# Altium project Control_Panel.PrjPCB
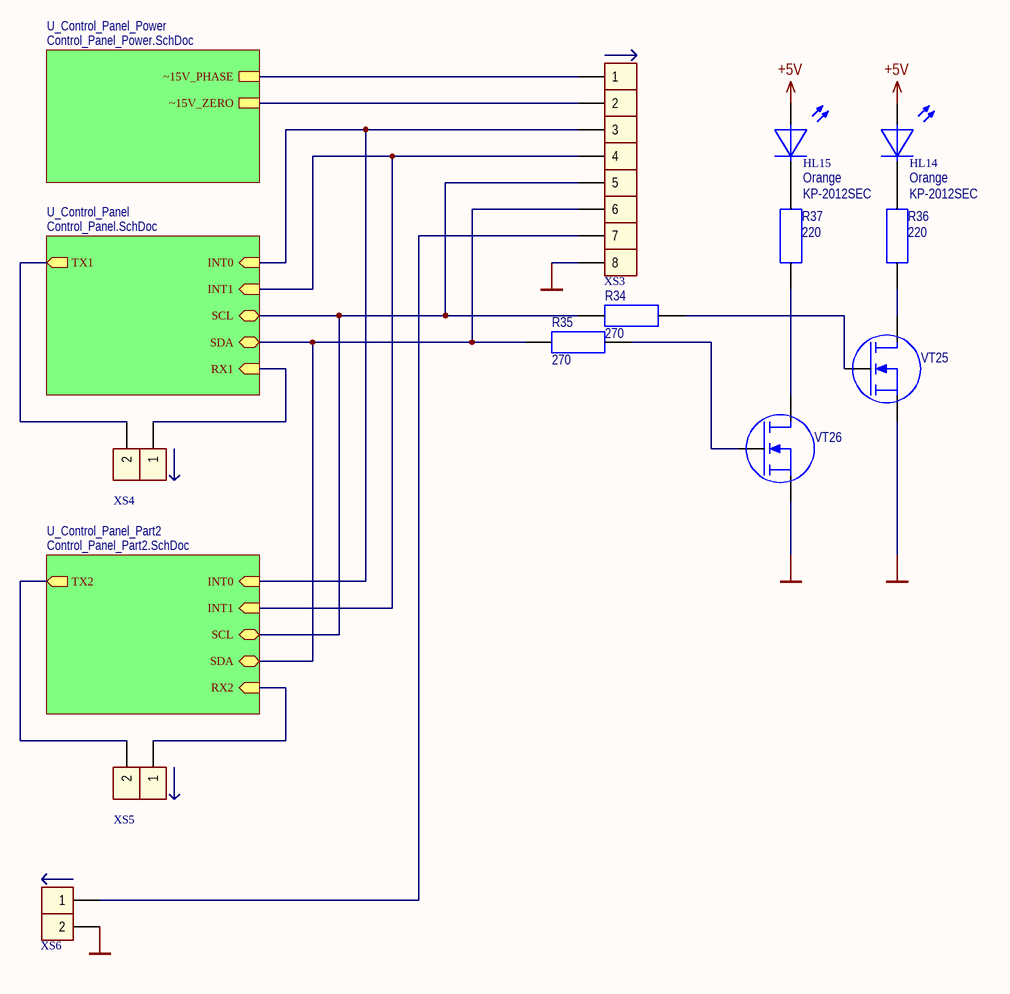
[diagram p0: TopShem.SchDoc]
5 sheets, 144 parts. Net scope: hierarchical (ports join the sheet entries above them; power ports are global).
Board file: Control_Panel.PcbDoc
Sheets:
  TopShem.SchDoc
    U_Control_Panel_Power = Control_Panel_Power.SchDoc
    U_Control_Panel = Control_Panel.SchDoc
    U_Control_Panel_Part2 = Control_Panel_Part2.SchDoc
      TransistorArray = TransistorArray.SchDoc

## Sheet TopShem.SchDoc: Наименование
size 420 x 297 mm; ApprovedBy: Сидоров; CheckedBy: Петров; Author: Иванов; CompanyName: РГППУ; Title2str: Изделия; DecimalNumber: АБВГ.123456.001 33

### Parts
HL14  Orange  ManufacturerPartNumber: KP-2012SEC  [DIOMELF2012M]
HL15  Orange  ManufacturerPartNumber: KP-2012SEC  [DIOMELF2012M]
R34  270  [SMDRC0805]
R35  270  [SMDRC0805]
R36  220  [SMDRC0805]
R37  220  [SMDRC0805]
VT25  2N7002  [SOT23 (TO-236AB)]  (value not drawn)
VT26  2N7002  [SOT23 (TO-236AB)]  (value not drawn)
XS3  PLS-08R  [PLS-08R2]  (value not drawn)
XS4  PLS-02  [PLS-02]  (value not drawn)
XS5  PLS-02  [PLS-02]  (value not drawn)
XS6  PLS-02R  [PLS-02R1]  (value not drawn)

### Sub-sheets
U_Control_Panel = Control_Panel.SchDoc: INT0 (in), INT1 (in), SCL (bidir), SDA (bidir), RX1 (in), TX1 (out)
U_Control_Panel_Part2 = Control_Panel_Part2.SchDoc: INT0 (in), INT1 (in), SCL (bidir), SDA (bidir), RX2 (in), TX2 (out)
U_Control_Panel_Power = Control_Panel_Power.SchDoc: ~15V_PHASE, ~15V_ZERO

### Nets
+5V: HL14.1 HL15.1
GND: VT25.2(S) VT26.2(S) XS3.8 XS6.2
INT0: XS3.3 ; sheet U_Control_Panel/INT0, sheet U_Control_Panel_Part2/INT0
INT1: XS3.4 ; sheet U_Control_Panel/INT1, sheet U_Control_Panel_Part2/INT1
RX1: XS4.1 ; sheet U_Control_Panel/RX1
RX2: XS5.1 ; sheet U_Control_Panel_Part2/RX2
SCL: R34.2 XS3.5 ; sheet U_Control_Panel/SCL, sheet U_Control_Panel_Part2/SCL
SDA: R35.2 XS3.6 ; sheet U_Control_Panel/SDA, sheet U_Control_Panel_Part2/SDA
TX1: XS4.2 ; sheet U_Control_Panel/TX1
TX2: XS5.2 ; sheet U_Control_Panel_Part2/TX2
~15V_PHASE: XS3.1 ; sheet U_Control_Panel_Power/~15V_PHASE
~15V_ZERO: XS3.2 ; sheet U_Control_Panel_Power/~15V_ZERO
NetHL14_2: HL14.2 R36.2
NetHL15_2: HL15.2 R37.2
NetR34_1: R34.1 VT25.1(G)
NetR35_1: R35.1 VT26.1(G)
NetR36_1: R36.1 VT25.3(D)
NetR37_1: R37.1 VT26.3(D)
NetXS3_7: XS3.7 XS6.1

### Notes on the sheet
- Изм.
- Лист
- N*докум.
- Подп.
- Дата
- Лит.
- Масса
- Масштаб
- Разраб.
- Пров.
- Т.контр.
- Лиcт
- Лиcтов
- Н.контр.
- Утв.

### Library data of the parts
HL14 HL15 = LED1_O: Diod LED SMD Orange; ComponentLink1Description: Datasheet; Cost: 4,91; ComponentLink2Description: Datasheet-local; ComponentLink2URL: *; Color: Orange
R34 R35 = Resistor 0805 270: Generic resistor; PartNumber: Resistor 0805 270; Value: 270; ComponentLink1URL: http://www.mouser.com/ds/2/447/PYu-RC0402_51_RoHS_L_6_r-8721.pdf; ComponentLink1Description: Datasheet; Package: 0805
R36 R37 = Resistor 0805 220: Generic resistor; PartNumber: Resistor 0805 220; Value: 220; ComponentLink1URL: http://www.mouser.com/ds/2/447/PYu-RC0402_51_RoHS_L_6_r-8721.pdf; ComponentLink1Description: Datasheet; Package: 0805
VT25 VT26 = 2N7002 n-MOSFET: 60V, 300mA N-channel Trench MOSFET; ManufacturerPartNumber: 2N7002
XS3 = Con8_M PLS-08MR: Male 8-pin connection; ManufacturerPartNumber: PLS-08R; ComponentLink1Description: Datasheet; ComponentLink1URL: http://www.promelec.ru/catalog/406/1218/1223/1/99528/; ComponentLink2Description: Datasheet-local; ComponentLink2URL: *
XS4 XS5 = Con2_M_PLS-02: Male 2-pin connection; ManufacturerPartNumber: PLS-02; ComponentLink1Description: Datasheet; ComponentLink1URL: http://www.promelec.ru/catalog/406/1218/1224/1/24233/; ComponentLink2Description: Datasheet-local; ComponentLink2URL: *
XS6 = Con2_M_PLS-02R: Male 2-pin connection; ManufacturerPartNumber: PLS-02R; ComponentLink1Description: Datasheet; ComponentLink1URL: http://www.promelec.ru/catalog/406/1218/1224/1/24233/; ComponentLink2Description: Datasheet-local; ComponentLink2URL: *

## Sheet Control_Panel_Power.SchDoc: Наименование
size 420 x 297 mm; ApprovedBy: Сидоров; CheckedBy: Петров; Author: Иванов; CompanyName: РГППУ; Title2str: Изделия; DecimalNumber: АБВГ.123456.001 33
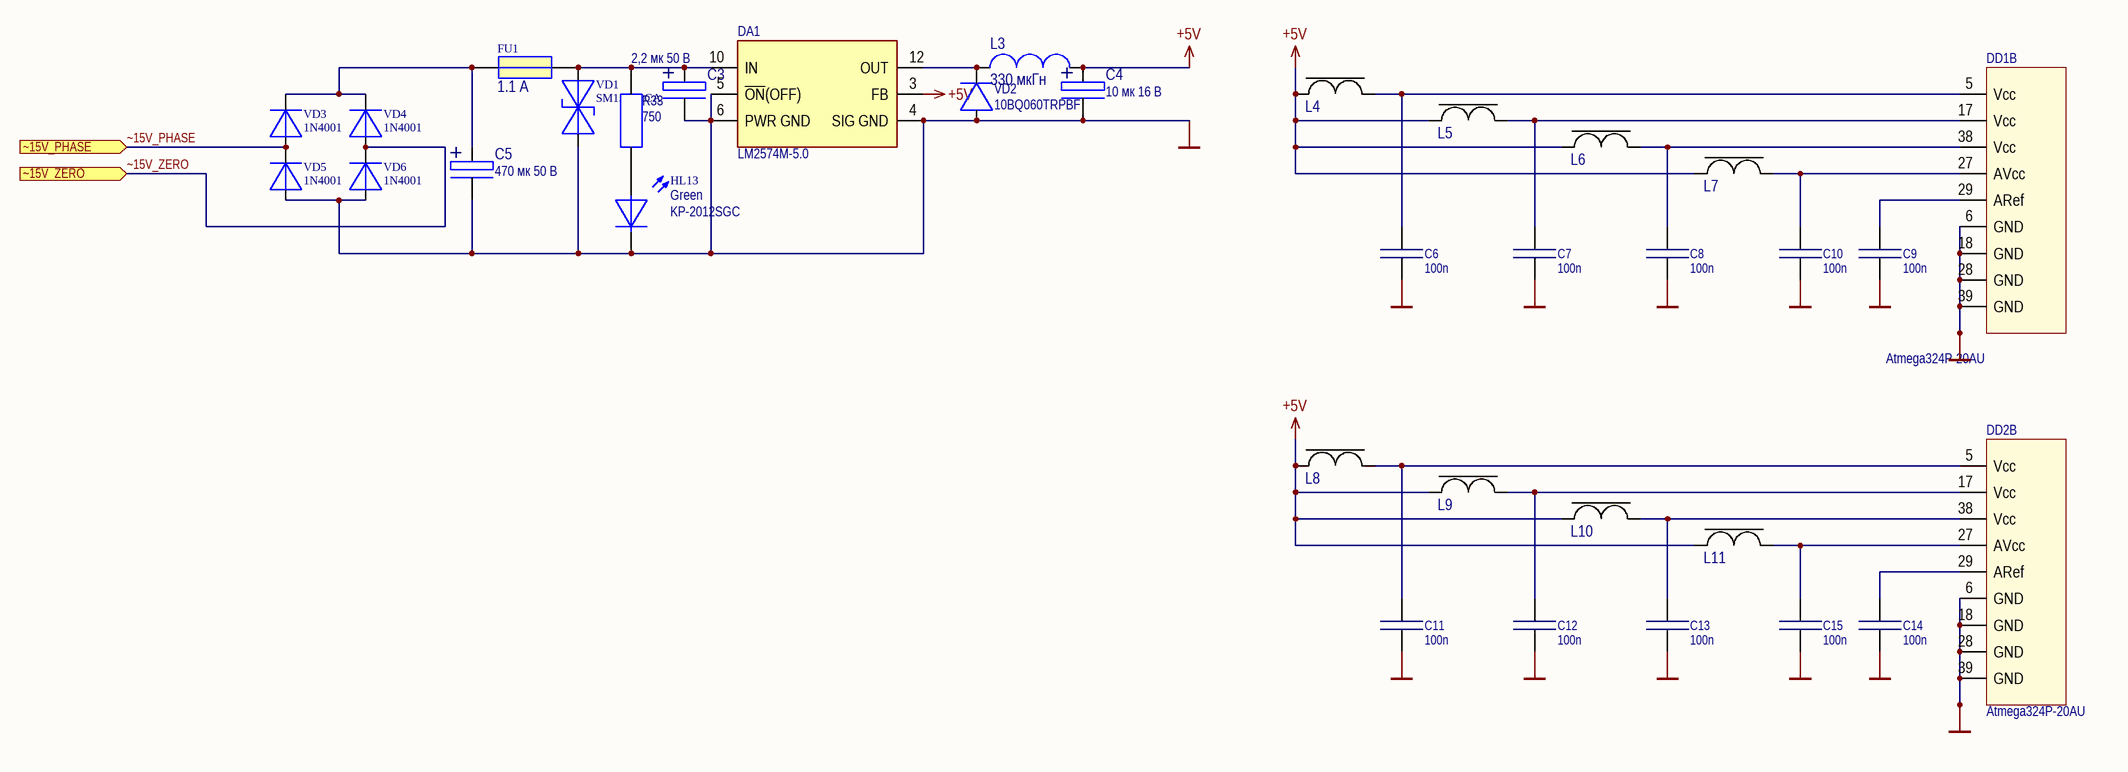
[diagram p1: Control_Panel_Power.SchDoc]

### Parts
C3  value 2,2 мк 50 В  [CAP_POLAR_ELLYTE_B]  (hidden comment: CA050M2R20REB-0405)
C4  value 10 мк 16 В  [CAP_POLAR_ELLYTE_B]  (hidden comment: CA016M0010REB-0405)
C5  value 470 мк 50 В  [CAP_POLAR_10mm]  (hidden comment: CA035M0220REG)
C6  100n  [SMDRC0805]
C7  100n  [SMDRC0805]
C8  100n  [SMDRC0805]
C9  100n  [SMDRC0805]
C10  100n  [SMDRC0805]
C11  100n  [SMDRC0805]
C12  100n  [SMDRC0805]
C13  100n  [SMDRC0805]
C14  100n  [SMDRC0805]
C15  100n  [SMDRC0805]
DA1  LM2574M-5.0  [SOIC127P1030X264-14M]
DD1  Atmega324P-20AU  [44ML_M]  (part B of 2)
DD2  Atmega324P-20AU  [44ML_M]  (part B of 2)
FU1  value 1.1 А  [EFuse 1.1A]  (hidden comment: EFuse LP60-110F)
HL13  Green  ManufacturerPartNumber: KP-2012SGC  [DIOMELF2012M]
L3  value 330 мкГн  [INDP7972X50M]  (hidden comment: SCD0705T-331K-N)
L4  MPZ1608S181A  [INDC0603X03M]  (value not drawn)
L5  MPZ1608S181A  [INDC0603X03M]  (value not drawn)
L6  MPZ1608S181A  [INDC0603X03M]  (value not drawn)
L7  MPZ1608S181A  [INDC0603X03M]  (value not drawn)
L8  MPZ1608S181A  [INDC0603X03M]  (value not drawn)
L9  MPZ1608S181A  [INDC0603X03M]  (value not drawn)
L10  MPZ1608S181A  [INDC0603X03M]  (value not drawn)
L11  MPZ1608S181A  [INDC0603X03M]  (value not drawn)
R33  750  [SMDRC0805]
VD1  SM15T12CA  [SUPRES3216X18N]
VD2  10BQ060TRPBF  [SHOTKY 4.1x3.3]
VD3  1N4001  [PinDiode]
VD4  1N4001  [PinDiode]
VD5  1N4001  [PinDiode]
VD6  1N4001  [PinDiode]

### Ports
~15V_PHASE, ~15V_ZERO

### Nets
+5V: C4.2(+) DA1.3(FB) L3.1 L4.1 L5.1 L6.1 L7.1 L8.1 L9.1 L10.1 L11.1
GND: C3.1(-) C4.1(-) C5.1(-) C6.2 C7.2 C8.2 C9.2 C10.1 C11.2 C12.2 C13.2 C14.2 C15.1 DA1.4(SIG_GND) DA1.5(~{ON}(OFF)) DA1.6(PWR_GND) DD1.6(GND) DD1.18(GND) DD1.28(GND) DD1.39(GND) DD2.6(GND) DD2.18(GND) DD2.28(GND) DD2.39(GND) HL13.2 VD1.1 VD2.A VD5.A VD6.A
~15V_PHASE: VD3.A VD5.K ; port ~15V_PHASE
~15V_ZERO: VD4.A VD6.K ; port ~15V_ZERO
NetC3_2: C3.2(+) DA1.10(IN) FU1.2 R33.2 VD1.2
NetC5_2: C5.2(+) FU1.1 VD3.K VD4.K
NetC6_1: C6.1 DD1.5(Vcc) L4.2
NetC7_1: C7.1 DD1.17(Vcc) L5.2
NetC8_1: C8.1 DD1.38(Vcc) L6.2
NetC9_1: C9.1 DD1.29(ARef)
NetC10_2: C10.2 DD1.27(AVcc) L7.2
NetC11_1: C11.1 DD2.5(Vcc) L8.2
NetC12_1: C12.1 DD2.17(Vcc) L9.2
NetC13_1: C13.1 DD2.38(Vcc) L10.2
NetC14_1: C14.1 DD2.29(ARef)
NetC15_2: C15.2 DD2.27(AVcc) L11.2
NetDA1_12: DA1.12(OUT) L3.2 VD2.K
NetHL13_1: HL13.1 R33.1

### Notes on the sheet
- Изм.
- Лист
- N*докум.
- Подп.
- Дата
- Лит.
- Масса
- Масштаб
- Разраб.
- Пров.
- Т.контр.
- Лиcт
- Лиcтов
- Н.контр.
- Утв.

### Library data of the parts
C3 = 02200_050: 2,2uF 50V Polar capacitor; Manufacturer: Yageo; ManufacturerPartNumber: CA050M2R20REB-0405; Supplier: Промэлектроника; Cost: 4,11; Package: not standard; ComponentLink1Description: Datasheet; ComponentLink1URL: http://www.yageo.com/documents/recent/E-Cap_SurfaceMount_CA_2011.pdf; ComponentLink2Description: Datasheet-local; ComponentLink2URL: *
C4 = 10000_016: 10uF 16V Polar SMD cap; Manufacturer: YAGEO; ManufacturerPartNumber: CA016M0010REB-0405; Supplier: -; Cost: 3,03; Package: штырьевой; ComponentLink1Description: Datasheet; ComponentLink2Description: Datasheet-local
C5 = 470000_050: 470uF 50V Polar capacitor; Manufacturer: Yageo; ManufacturerPartNumber: CA035M0220REG; Supplier: Промэлектроника; Cost: 20,14; Package: not standard; ComponentLink1Description: Datasheet; ComponentLink1URL: http://www.promelec.ru/pdf/CA_2011.pdf; ComponentLink2Description: Datasheet-local; ComponentLink2URL: *
C6-C15 = Capacitor 0805 100n: Generic capasitor non-polar; PartNumber: Capacitor 0805 100n; Value: 100n; ComponentLink1Description: Datasheet; Package: 0805
DD1 DD2 = Atmega324P-20AU: Microcontroller 8-bit; Manufacturer: Atmel; ComponentLink1URL: http://www.atmel.com/Images/Atmel-8011-8-bit-AVR-Microcontroller-ATmega164P-324P-644P_datasheet.pdf; ComponentLink1Description: Datasheet; Cost: 220; Package: TQFP-44; Supplier: Промэлектроника; ManufacturerPartNumber: Atmega324P-20AU
FU1 = EFuse LP60-110F: Fuse; ManufacturerPartNumber: EFuse LP60-110F; ComponentLink1Description: Datasheet; ComponentLink2Description: Datasheet-local; ComponentLink2URL: *
HL13 = LED1_G: Diod LED SMD Green; ComponentLink1Description: Datasheet; Cost: 2,88; ComponentLink2Description: Datasheet-local; ComponentLink2URL: *; Color: Green
L3 = SCD0705T-331K-N: Inductor; ManufacturerPartNumber: SCD0705T-331K-N; ComponentLink1Description: Datasheet; ComponentLink1URL: http://download.siliconexpert.com/pdfs/2010/12/8/6/47/4/732/yageo_/manual/inductors_smdpower_scd_2010.pdf; ComponentLink2Description: Datasheet-local; ComponentLink2URL: *
L4-L11 = Ferrite Bead: Value: ? мГн; ManufacturerPartNumber: MPZ1608S181A; ComponentLink1Description: Datasheet; Supplier: Промэлектроника; ComponentLink2Description: Datasheet-local; ComponentLink2URL: *
R33 = Resistor 0805 750: Generic resistor; PartNumber: Resistor 0805 750; Value: 750; ComponentLink1URL: http://www.mouser.com/ds/2/447/PYu-RC0402_51_RoHS_L_6_r-8721.pdf; ComponentLink1Description: Datasheet; Package: 0805
VD1 = SM15T12CA: Diod suppressor; Manufacturer: ST Microelectronics; Notes: 12 В; ComponentLink1Description: Datasheet; ComponentLink1URL: http://www.st.com/st-web-ui/static/active/en/resource/technical/document/datasheet/CD00000724.pdf; Cost: 16,73; Package: SMC/DO-214AB; Supplier: Промэлектроника; ComponentLink2Description: Datasheet-local; ComponentLink2URL: *; ManufacturerPartNumber: SM15T12CA
VD2 = 10BQ060TRPBF: DIODE SCHOTTKY 60V 1A DO214AA; Manufacturer: Vishay Semiconductor Diodes Division; Voltage - Forward (Vf) (Max) @ If: 600mV @ 1A; Current - Reverse Leakage @ Vr: 100µA @ 60V; Category: Discrete Semiconductor Products; Diode Type: Schottky; Voltage - DC Reverse (Vr) (Max): 60V; Current - Average Rectified (Io): 1A; Reverse Recovery Time (trr): -; Mounting Type: Surface Mount; Package / Case: DO-214AA, SMB; Operating Temperature - Junction: -55°C ~ 150°C; ComponentLink1URL: http://www.vishay.com/docs/94113/vs-10bq060pbf.pdf; ComponentLink1Description: http://www.vishay.com/docs/94113/vs-10bq060pbf.pdf; ManufacturerPartNumber: 10BQ060TRPBF
VD3-VD6 = 1N4001: Rectifying diode; ComponentLink1Description: Datasheet; ComponentLink1URL: http://www.promelec.ru/pdf/1N400x.pdf; Cost: 5; Package: штырьевой; ComponentLink2Description: Datasheet-local; ComponentLink2URL: *; ManufacturerPartNumber: 1N4001
DA1 = LM2574M-5.0: ManufacturerPartNumber: LM2574M-5.0

## Sheet Control_Panel.SchDoc: Наименование
size 420 x 297 mm; ApprovedBy: Сидоров; CheckedBy: Петров; Author: Иванов; CompanyName: РГППУ; Title2str: Изделия; DecimalNumber: АБВГ.123456.001 33
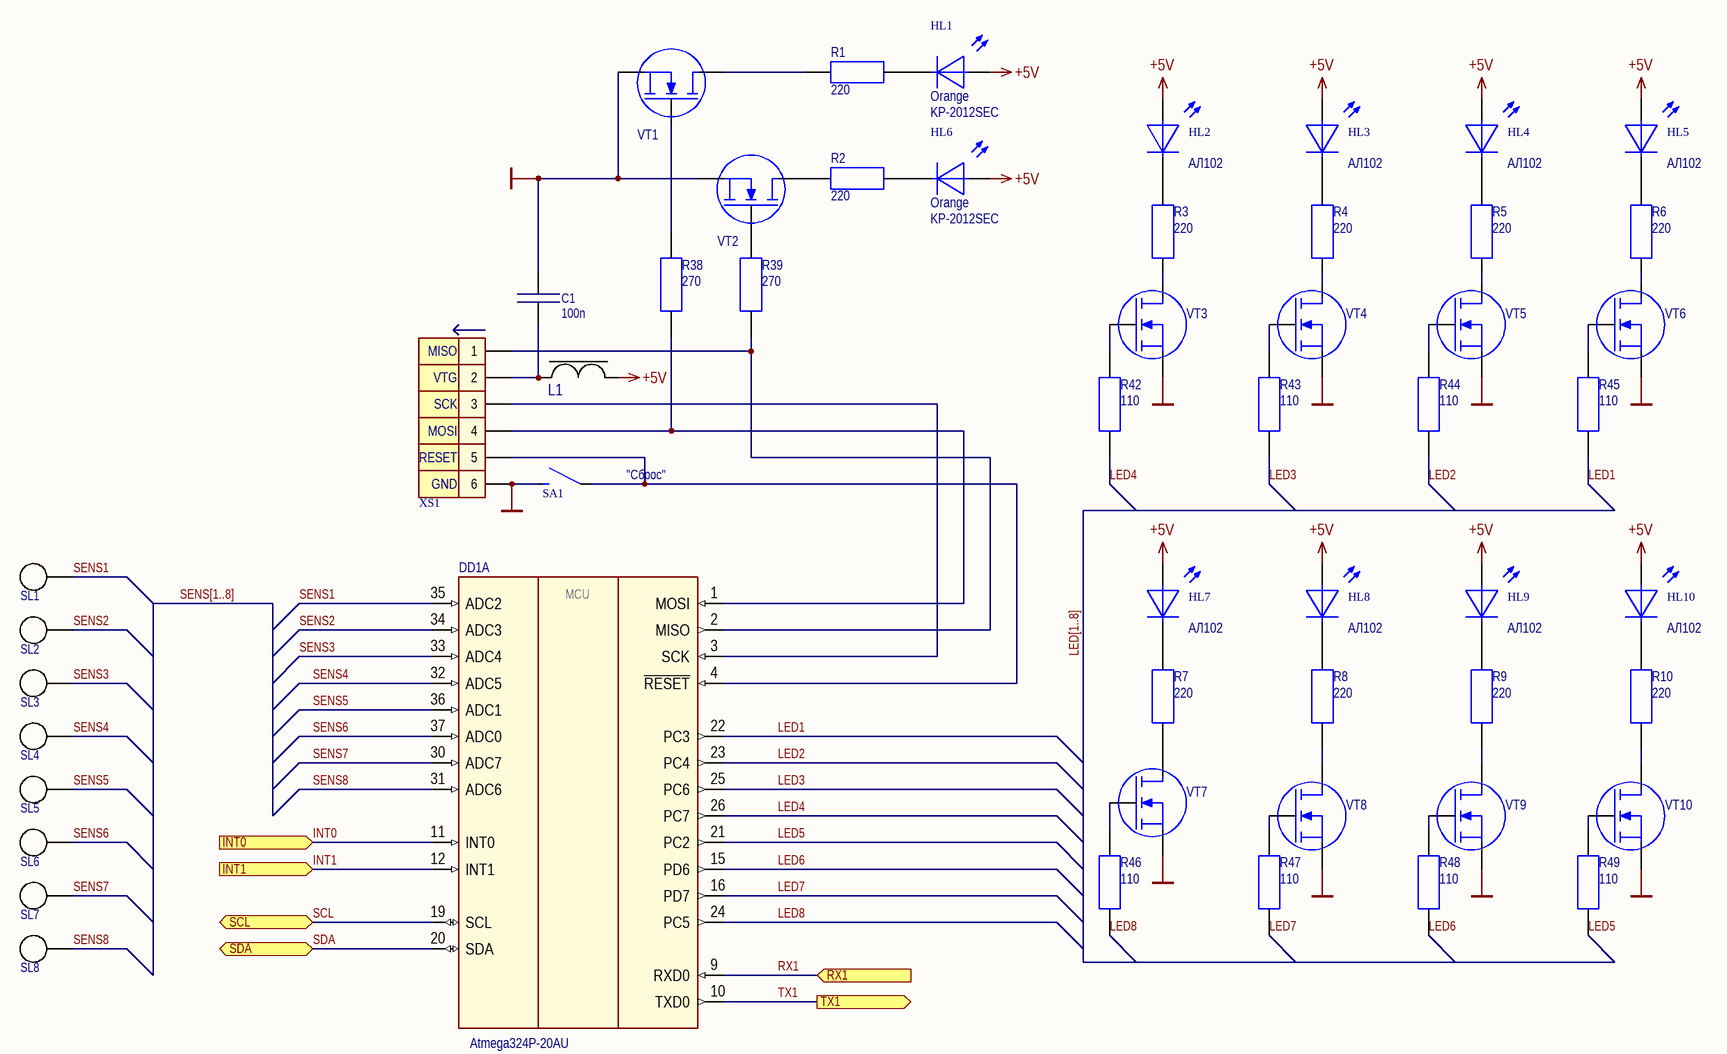
[diagram p2: Control_Panel.SchDoc]

### Parts
C1  100n  [SMDRC0805]
DD1  Atmega324P-20AU  [44ML_M]  (part A of 2)
HL1  Orange  ManufacturerPartNumber: KP-2012SEC  [DIOMELF2012M]
HL2  ManufacturerPartNumber: АЛ102  [LED_diode]
HL3  ManufacturerPartNumber: АЛ102  [LED_diode]
HL4  ManufacturerPartNumber: АЛ102  [LED_diode]
HL5  ManufacturerPartNumber: АЛ102  [LED_diode]
HL6  Orange  ManufacturerPartNumber: KP-2012SEC  [DIOMELF2012M]
HL7  ManufacturerPartNumber: АЛ102  [LED_diode]
HL8  ManufacturerPartNumber: АЛ102  [LED_diode]
HL9  ManufacturerPartNumber: АЛ102  [LED_diode]
HL10  ManufacturerPartNumber: АЛ102  [LED_diode]
L1  MPZ1608S181A  [INDC0603X03M]  (value not drawn)
R1  220  [SMDRC0805]
R2  220  [SMDRC0805]
R3  220  [SMDRC0805]
R4  220  [SMDRC0805]
R5  220  [SMDRC0805]
R6  220  [SMDRC0805]
R7  220  [SMDRC0805]
R8  220  [SMDRC0805]
R9  220  [SMDRC0805]
R10  220  [SMDRC0805]
R38  270  [SMDRC0805]
R39  270  [SMDRC0805]
R42  110  [SMDRC0805]
R43  110  [SMDRC0805]
R44  110  [SMDRC0805]
R45  110  [SMDRC0805]
R46  110  [SMDRC0805]
R47  110  [SMDRC0805]
R48  110  [SMDRC0805]
R49  110  [SMDRC0805]
SA1  DTSM20-4.3  [DTSM20]  (value not drawn)
SL1  Touch_sensor  [Bolt 6mm]  (value not drawn)
SL2  Touch_sensor  [Bolt 6mm]  (value not drawn)
SL3  Touch_sensor  [Bolt 6mm]  (value not drawn)
SL4  Touch_sensor  [Bolt 6mm]  (value not drawn)
SL5  Touch_sensor  [Bolt 6mm]  (value not drawn)
SL6  Touch_sensor  [Bolt 6mm]  (value not drawn)
SL7  Touch_sensor  [Bolt 6mm]  (value not drawn)
SL8  Touch_sensor  [Bolt 6mm]  (value not drawn)
VT1  2N7002  [SOT23 (TO-236AB)]  (value not drawn)
VT2  2N7002  [SOT23 (TO-236AB)]  (value not drawn)
VT3  2N7002  [SOT23 (TO-236AB)]  (value not drawn)
VT4  2N7002  [SOT23 (TO-236AB)]  (value not drawn)
VT5  2N7002  [SOT23 (TO-236AB)]  (value not drawn)
VT6  2N7002  [SOT23 (TO-236AB)]  (value not drawn)
VT7  2N7002  [SOT23 (TO-236AB)]  (value not drawn)
VT8  2N7002  [SOT23 (TO-236AB)]  (value not drawn)
VT9  2N7002  [SOT23 (TO-236AB)]  (value not drawn)
VT10  2N7002  [SOT23 (TO-236AB)]  (value not drawn)
XS1  IDC-06M  [IDC-06M]  (value not drawn)

### Ports
INT0 (in), INT1 (in), RX1 (in), SCL (bidir), SDA (bidir), TX1 (out)

### Nets
+5V: HL1.1 HL2.A HL3.A HL4.A HL5.A HL6.1 HL7.A HL8.A HL9.A HL10.A L1.1
GND: C1.2 SA1.2 VT1.2(S) VT2.2(S) VT3.2(S) VT4.2(S) VT5.2(S) VT6.2(S) VT7.2(S) VT8.2(S) VT9.2(S) VT10.2(S) XS1.6
INT0: DD1.11(INT0) ; port INT0
INT1: DD1.12(INT1) ; port INT1
LED1: DD1.22(PC3) R45.1
LED2: DD1.23(PC4) R44.1
LED3: DD1.25(PC6) R43.1
LED4: DD1.26(PC7) R42.1
LED5: DD1.21(PC2) R49.1
LED6: DD1.15(PD6) R48.1
LED7: DD1.16(PD7) R47.1
LED8: DD1.24(PC5) R46.1
RX1: DD1.9(RXD0) ; port RX1
SCL: DD1.19(SCL) ; port SCL
SDA: DD1.20(SDA) ; port SDA
SENS1: DD1.35(ADC2) SL1.1
SENS2: DD1.34(ADC3) SL2.1
SENS3: DD1.33(ADC4) SL3.1
SENS4: DD1.32(ADC5) SL4.1
SENS5: DD1.36(ADC1) SL5.1
SENS6: DD1.37(ADC0) SL6.1
SENS7: DD1.30(ADC7) SL7.1
SENS8: DD1.31(ADC6) SL8.1
TX1: DD1.10(TXD0) ; port TX1
NetC1_1: C1.1 L1.2 XS1.2
NetDD1_1: DD1.1(MOSI) R38.1 XS1.4
NetDD1_2: DD1.2(MISO) R39.1 XS1.1
NetDD1_3: DD1.3(SCK) XS1.3
NetDD1_4: DD1.4(~{RESET}) SA1.1 XS1.5
NetHL1_2: HL1.2 R1.2
NetHL2_K: HL2.K R3.2
NetHL3_K: HL3.K R4.2
NetHL4_K: HL4.K R5.2
NetHL5_K: HL5.K R6.2
NetHL6_2: HL6.2 R2.2
NetHL7_K: HL7.K R7.2
NetHL8_K: HL8.K R8.2
NetHL9_K: HL9.K R9.2
NetHL10_K: HL10.K R10.2
NetR1_1: R1.1 VT1.3(D)
NetR2_1: R2.1 VT2.3(D)
NetR3_1: R3.1 VT3.3(D)
NetR4_1: R4.1 VT4.3(D)
NetR5_1: R5.1 VT5.3(D)
NetR6_1: R6.1 VT6.3(D)
NetR7_1: R7.1 VT7.3(D)
NetR8_1: R8.1 VT8.3(D)
NetR9_1: R9.1 VT9.3(D)
NetR10_1: R10.1 VT10.3(D)
NetR38_2: R38.2 VT1.1(G)
NetR39_2: R39.2 VT2.1(G)
NetR42_2: R42.2 VT3.1(G)
NetR43_2: R43.2 VT4.1(G)
NetR44_2: R44.2 VT5.1(G)
NetR45_2: R45.2 VT6.1(G)
NetR46_2: R46.2 VT7.1(G)
NetR47_2: R47.2 VT8.1(G)
NetR48_2: R48.2 VT9.1(G)
NetR49_2: R49.2 VT10.1(G)

### Buses and harness runs
bus LED[1..8]
bus SENS[1..8]

### Notes on the sheet
- (near SA1) "Сброс"
- Изм.
- Лист
- N*докум.
- Подп.
- Дата
- Лит.
- Масса
- Масштаб
- Разраб.
- Пров.
- Т.контр.
- Лиcт
- Лиcтов
- Н.контр.
- Утв.
- (in symbol Atmega324P-20AU, part A) MCU
- (in symbol Con6_M IDC-06M_SPI) MISO; VTG; SCK; MOSI; RESET; GND

### Library data of the parts
C1 = Capacitor 0805 100n: Generic capasitor non-polar; PartNumber: Capacitor 0805 100n; Value: 100n; ComponentLink1Description: Datasheet; Package: 0805
DD1 = Atmega324P-20AU: as DD1 on sheet Control_Panel_Power; ComponentLink1URL: http://www.atmel.com/Images/Atmel-8011-8-bit-AVR-Microcontroller-ATmega164P-324P-644P_datasheet.pdf; ComponentLink1Description: Datasheet; Cost: 220; Package: TQFP-44; Supplier: Промэлектроника; ManufacturerPartNumber: Atmega324P-20AU
HL1 HL6 = LED1_O: Diod LED SMD Orange; ComponentLink1Description: Datasheet; Cost: 4,91; ComponentLink2Description: Datasheet-local; ComponentLink2URL: *; Color: Orange
HL2-HL5 HL7-HL10 = _LED1_АЛ102: Diod LED; Manufacturer: СССР; ComponentLink1Description: Datasheet; Package: штырьевой; ComponentLink2Description: Datasheet-local
L1 = Ferrite Bead: Value: ? мГн; ManufacturerPartNumber: MPZ1608S181A; ComponentLink1Description: Datasheet; Supplier: Промэлектроника; ComponentLink2Description: Datasheet-local; ComponentLink2URL: *
R1-R10 = Resistor 0805 220: Generic resistor; PartNumber: Resistor 0805 220; Value: 220; ComponentLink1URL: http://www.mouser.com/ds/2/447/PYu-RC0402_51_RoHS_L_6_r-8721.pdf; ComponentLink1Description: Datasheet; Package: 0805
R38 R39 = Resistor 0805 270: Generic resistor; PartNumber: Resistor 0805 270; Value: 270; ComponentLink1URL: http://www.mouser.com/ds/2/447/PYu-RC0402_51_RoHS_L_6_r-8721.pdf; ComponentLink1Description: Datasheet; Package: 0805
R42-R49 = Resistor 0805 110: Generic resistor; PartNumber: Resistor 0805 110; Value: 110; ComponentLink1URL: http://www.mouser.com/ds/2/447/PYu-RC0402_51_RoHS_L_6_r-8721.pdf; ComponentLink1Description: Datasheet; Package: 0805
SA1 = Switch1_DTSM20-4.3: Switch open; Manufacturer: Diptronics; ManufacturerPartNumber: DTSM20-4.3; ComponentLink1Description: Datasheet; ComponentLink1URL: http://www.promelec.ru/catalog/407/1291/1323/1/70721/; ComponentLink2Description: Datasheet-local; ComponentLink2URL: *
SL1-SL8 = Touch_sensor: Bolt touch sensor
VT1-VT10 = 2N7002 n-MOSFET: 60V, 300mA N-channel Trench MOSFET; ManufacturerPartNumber: 2N7002
XS1 = Con6_M IDC-06M_SPI: SPI connector; ManufacturerPartNumber: IDC-06M; ComponentLink1Description: Datasheet; ComponentLink1URL: http://www.promelec.ru/catalog/406/1218/1223/1/156430/; ComponentLink2Description: Datasheet-local; ComponentLink2URL: *

## Sheet Control_Panel_Part2.SchDoc: Наименование
size 420 x 297 mm; ApprovedBy: Сидоров; CheckedBy: Петров; Author: Иванов; CompanyName: РГППУ; Title2str: Изделия; DecimalNumber: АБВГ.123456.001 33
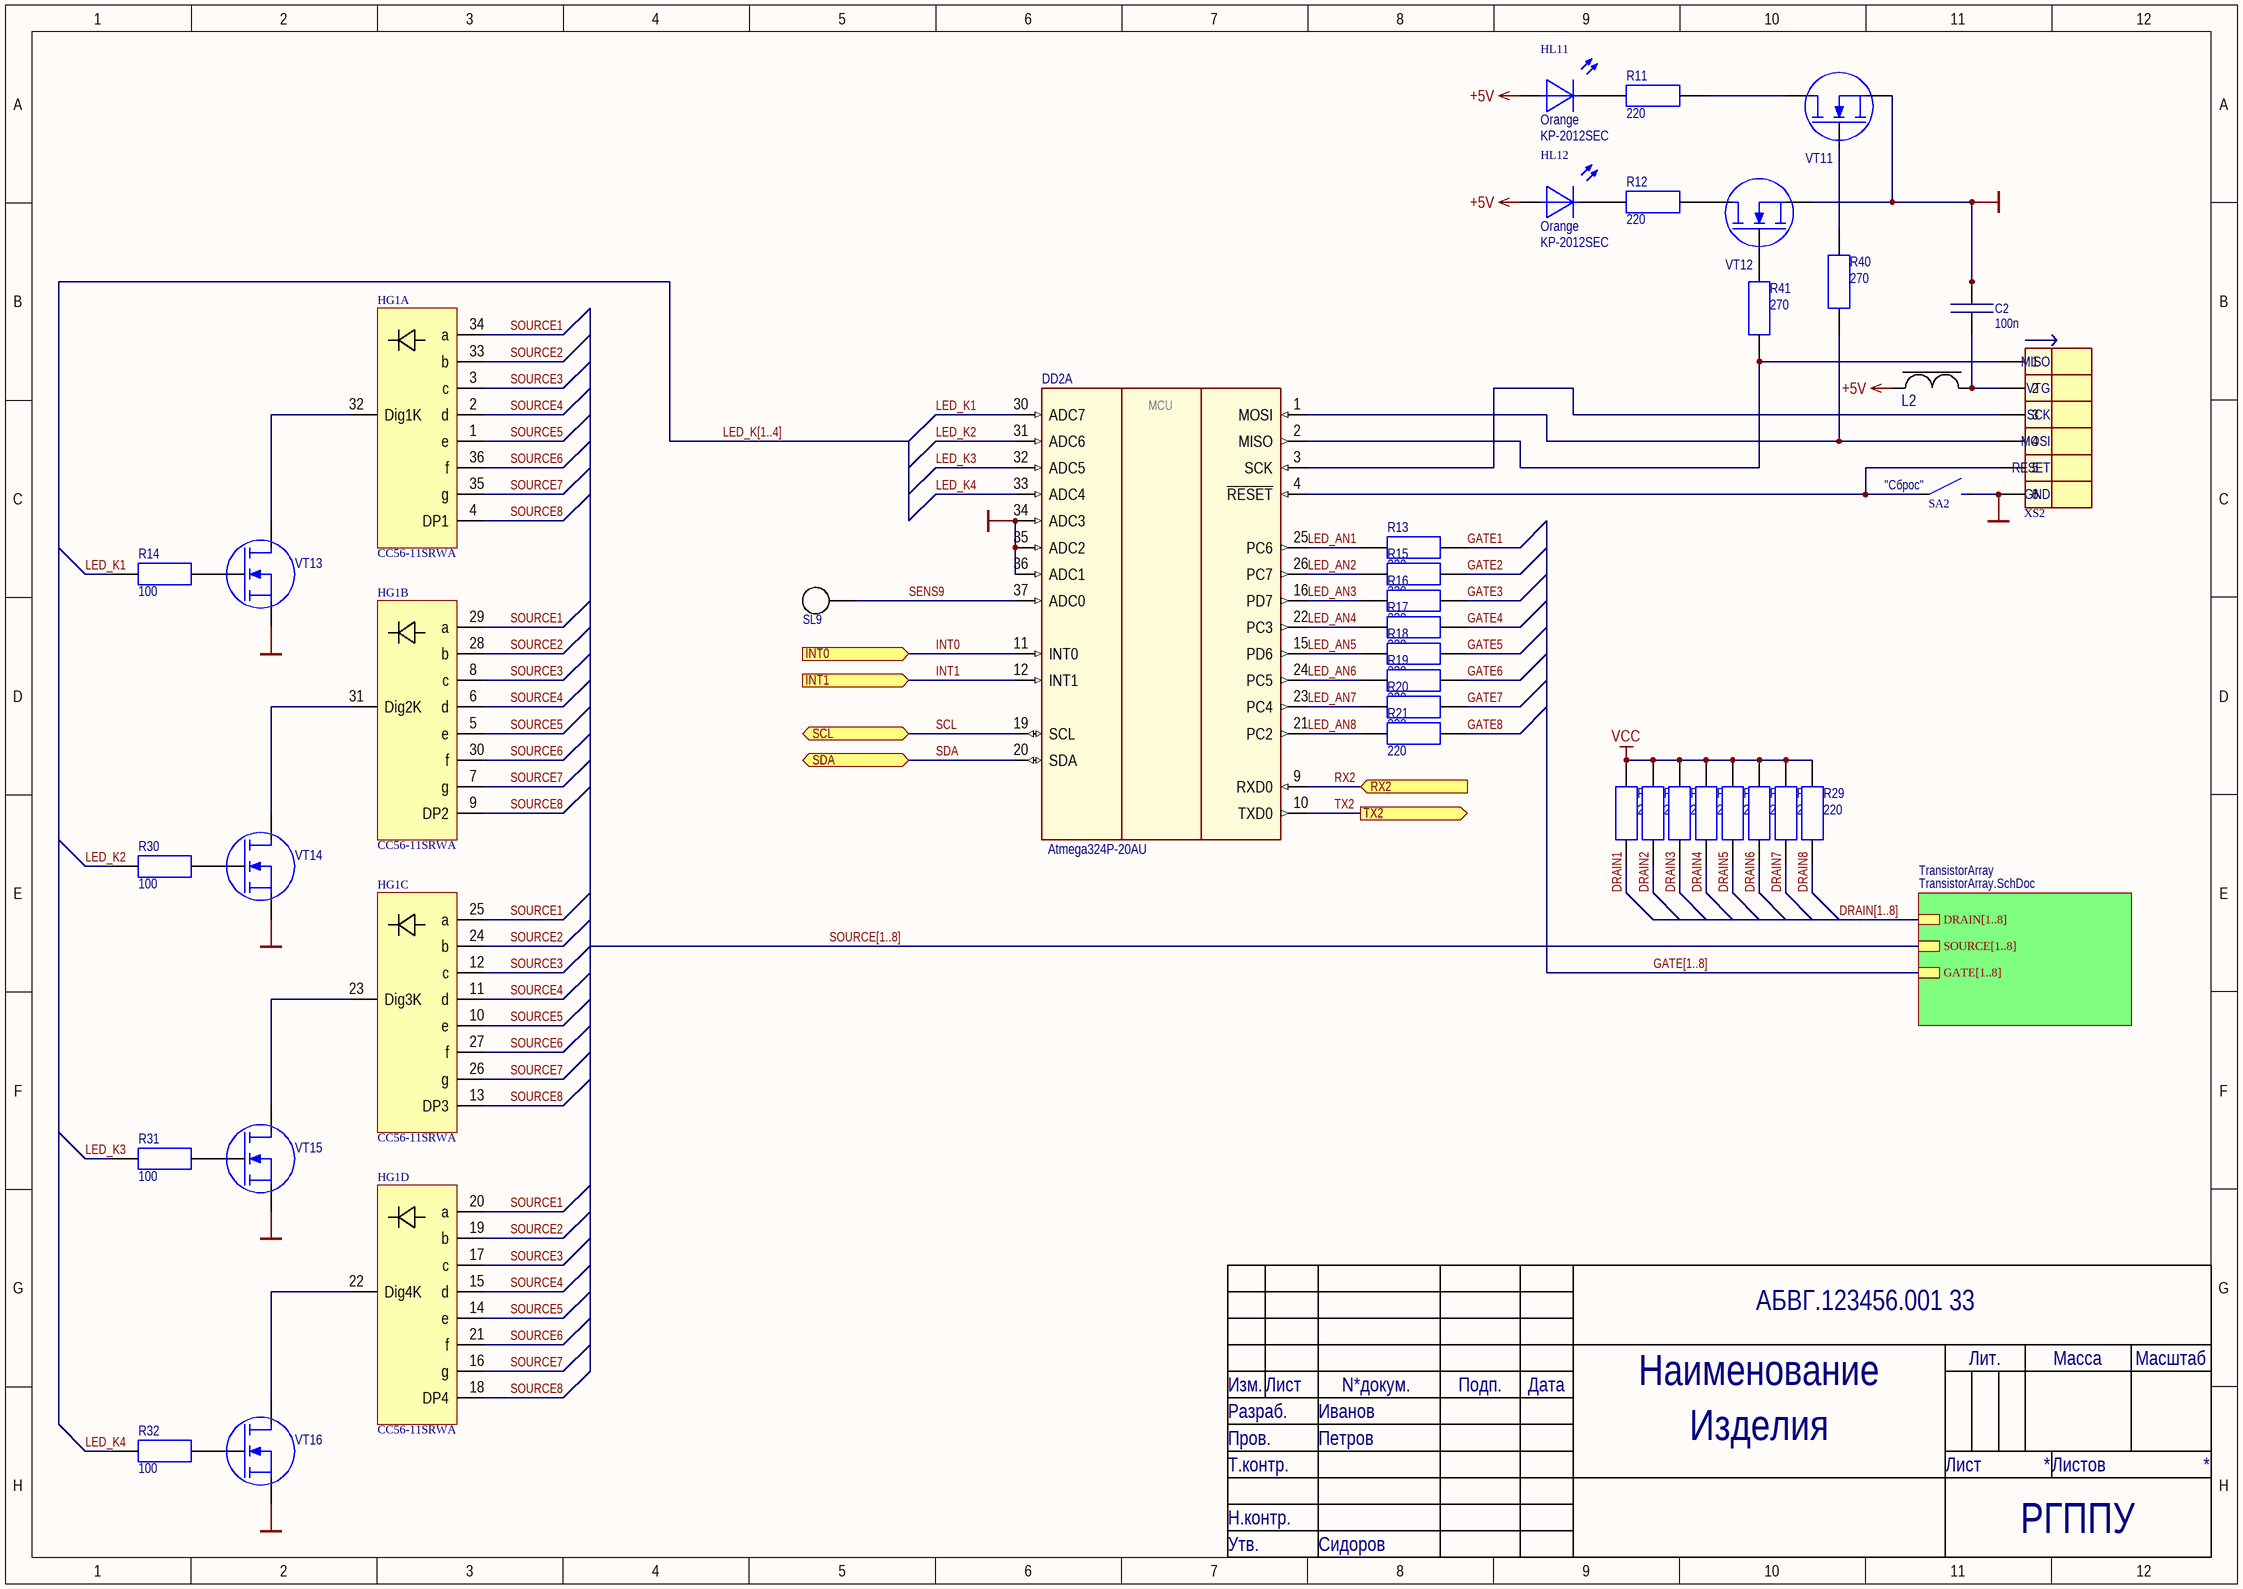
[diagram p3: Control_Panel_Part2.SchDoc]

### Parts
C2  100n  [SMDRC0805]
DD2  Atmega324P-20AU  [44ML_M]  (part A of 2)
HG1  CC56-11SRWA  [CC56-11SRWA]  (parts A,B,C,D of 4)
HL11  Orange  ManufacturerPartNumber: KP-2012SEC  [DIOMELF2012M]
HL12  Orange  ManufacturerPartNumber: KP-2012SEC  [DIOMELF2012M]
L2  MPZ1608S181A  [INDC0603X03M]  (value not drawn)
R11  220  [SMDRC0805]
R12  220  [SMDRC0805]
R13  220  [SMDRC0805]
R14  100  [SMDRC0805]
R15  220  [SMDRC0805]
R16  220  [SMDRC0805]
R17  220  [SMDRC0805]
R18  220  [SMDRC0805]
R19  220  [SMDRC0805]
R20  220  [SMDRC0805]
R21  220  [SMDRC0805]
R22  220  [SMDRC0805]
R23  220  [SMDRC0805]
R24  220  [SMDRC0805]
R25  220  [SMDRC0805]
R26  220  [SMDRC0805]
R27  220  [SMDRC0805]
R28  220  [SMDRC0805]
R29  220  [SMDRC0805]
R30  100  [SMDRC0805]
R31  100  [SMDRC0805]
R32  100  [SMDRC0805]
R40  270  [SMDRC0805]
R41  270  [SMDRC0805]
SA2  DTSM20-4.3  [DTSM20]  (value not drawn)
SL9  Touch_sensor  [Bolt 6mm]  (value not drawn)
VT11  2N7002  [SOT23 (TO-236AB)]  (value not drawn)
VT12  2N7002  [SOT23 (TO-236AB)]  (value not drawn)
VT13  2N7002  [SOT23 (TO-236AB)]  (value not drawn)
VT14  2N7002  [SOT23 (TO-236AB)]  (value not drawn)
VT15  2N7002  [SOT23 (TO-236AB)]  (value not drawn)
VT16  2N7002  [SOT23 (TO-236AB)]  (value not drawn)
XS2  IDC-06M  [IDC-06M]  (value not drawn)

### Sub-sheets
TransistorArray = TransistorArray.SchDoc: DRAIN[1..8], SOURCE[1..8], GATE[1..8]

### Ports
INT0 (in), INT1 (in), RX2 (in), SCL (bidir), SDA (bidir), TX2 (out)

### Nets
+5V: HL11.1 HL12.1 L2.1
GND: C2.2 DD2.34(ADC3) DD2.35(ADC2) DD2.36(ADC1) SA2.2 VT11.2(S) VT12.2(S) VT13.2(S) VT14.2(S) VT15.2(S) VT16.2(S) XS2.6
VCC: R22.2 R23.2 R24.2 R25.2 R26.2 R27.2 R28.2 R29.2
DRAIN1: R22.1
DRAIN2: R23.1
DRAIN3: R24.1
DRAIN4: R25.1
DRAIN5: R26.1
DRAIN6: R27.1
DRAIN7: R28.1
DRAIN8: R29.1
GATE1: R13.2
GATE2: R15.2
GATE3: R16.2
GATE4: R17.2
GATE5: R18.2
GATE6: R19.2
GATE7: R20.2
GATE8: R21.2
INT0: DD2.11(INT0) ; port INT0
INT1: DD2.12(INT1) ; port INT1
LED_AN1: DD2.25(PC6) R13.1
LED_AN2: DD2.26(PC7) R15.1
LED_AN3: DD2.16(PD7) R16.1
LED_AN4: DD2.22(PC3) R17.1
LED_AN5: DD2.15(PD6) R18.1
LED_AN6: DD2.24(PC5) R19.1
LED_AN7: DD2.23(PC4) R20.1
LED_AN8: DD2.21(PC2) R21.1
LED_K1: DD2.30(ADC7) R14.1
LED_K2: DD2.31(ADC6) R30.1
LED_K3: DD2.32(ADC5) R31.1
LED_K4: DD2.33(ADC4) R32.1
RX2: DD2.9(RXD0) ; port RX2
SCL: DD2.19(SCL) ; port SCL
SDA: DD2.20(SDA) ; port SDA
SENS9: DD2.37(ADC0) SL9.1
SOURCE1: HG1.20(a) HG1.25(a) HG1.29(a) HG1.34(a)
SOURCE2: HG1.19(b) HG1.24(b) HG1.28(b) HG1.33(b)
SOURCE3: HG1.3(c) HG1.8(c) HG1.12(c) HG1.17(c)
SOURCE4: HG1.2(d) HG1.6(d) HG1.11(d) HG1.15(d)
SOURCE5: HG1.1(e) HG1.5(e) HG1.10(e) HG1.14(e)
SOURCE6: HG1.21(f) HG1.27(f) HG1.30(f) HG1.36(f)
SOURCE7: HG1.7(g) HG1.16(g) HG1.26(g) HG1.35(g)
SOURCE8: HG1.4(DP1) HG1.9(DP2) HG1.13(DP3) HG1.18(DP4)
TX2: DD2.10(TXD0) ; port TX2
NetC2_1: C2.1 L2.2 XS2.2
NetDD2_1: DD2.1(MOSI) R40.1 XS2.4
NetDD2_2: DD2.2(MISO) R41.1 XS2.1
NetDD2_3: DD2.3(SCK) XS2.3
NetDD2_4: DD2.4(~{RESET}) SA2.1 XS2.5
NetHG1_22: HG1.22(Dig4K) VT16.3(D)
NetHG1_23: HG1.23(Dig3K) VT15.3(D)
NetHG1_31: HG1.31(Dig2K) VT14.3(D)
NetHG1_32: HG1.32(Dig1K) VT13.3(D)
NetHL11_2: HL11.2 R11.2
NetHL12_2: HL12.2 R12.2
NetR11_1: R11.1 VT11.3(D)
NetR12_1: R12.1 VT12.3(D)
NetR14_2: R14.2 VT13.1(G)
NetR30_2: R30.2 VT14.1(G)
NetR31_2: R31.2 VT15.1(G)
NetR32_2: R32.2 VT16.1(G)
NetR40_2: R40.2 VT11.1(G)
NetR41_2: R41.2 VT12.1(G)

### Buses and harness runs
bus DRAIN[1..8] = sheet TransistorArray/DRAIN[1..8]
bus GATE[1..8] = sheet TransistorArray/GATE[1..8]
bus LED_K[1..4]
bus SOURCE[1..8] = sheet TransistorArray/SOURCE[1..8]

### Notes on the sheet
- (near SA2) "Сброс"
- Изм.
- Лист
- N*докум.
- Подп.
- Дата
- Лит.
- Масса
- Масштаб
- Разраб.
- Пров.
- Т.контр.
- Лиcт
- Лиcтов
- Н.контр.
- Утв.
- (in symbol Atmega324P-20AU, part A) MCU
- (in symbol Con6_M IDC-06M_SPI) MISO; VTG; SCK; MOSI; RESET; GND

### Library data of the parts
C2 = Capacitor 0805 100n: Generic capasitor non-polar; PartNumber: Capacitor 0805 100n; Value: 100n; ComponentLink1Description: Datasheet; Package: 0805
DD2 = Atmega324P-20AU: as DD1 on sheet Control_Panel_Power; ComponentLink1URL: http://www.atmel.com/Images/Atmel-8011-8-bit-AVR-Microcontroller-ATmega164P-324P-644P_datasheet.pdf; ComponentLink1Description: Datasheet; Cost: 220; Package: TQFP-44; Supplier: Промэлектроника; ManufacturerPartNumber: Atmega324P-20AU
HG1 = CC56-11SRWA: The Super Bright Red source color devices are made with  Gallium Aluminum Arsenide Red Light Emitting Diode.; Manufacturer: Kingbright; ComponentLink1Description: Datasheet; ComponentLink1URL: http://lib.chipdip.ru/195/DOC000195478.pdf; Cost: 151.88; ManufacturerPartNumber: CC56-11SRWA; Notes: *; Package: not standard; Supplier: Промэлектроника
HL11 HL12 = LED1_O: Diod LED SMD Orange; ComponentLink1Description: Datasheet; Cost: 4,91; ComponentLink2Description: Datasheet-local; ComponentLink2URL: *; Color: Orange
L2 = Ferrite Bead: Value: ? мГн; ManufacturerPartNumber: MPZ1608S181A; ComponentLink1Description: Datasheet; Supplier: Промэлектроника; ComponentLink2Description: Datasheet-local; ComponentLink2URL: *
R11-R13 R15-R29 = Resistor 0805 220: Generic resistor; PartNumber: Resistor 0805 220; Value: 220; ComponentLink1URL: http://www.mouser.com/ds/2/447/PYu-RC0402_51_RoHS_L_6_r-8721.pdf; ComponentLink1Description: Datasheet; Package: 0805
R14 R30-R32 = Resistor 0805 100: Generic resistor; PartNumber: Resistor 0805 100; Value: 100; ComponentLink1URL: http://www.mouser.com/ds/2/447/PYu-RC0402_51_RoHS_L_6_r-8721.pdf; ComponentLink1Description: Datasheet; Package: 0805
R40 R41 = Resistor 0805 270: Generic resistor; PartNumber: Resistor 0805 270; Value: 270; ComponentLink1URL: http://www.mouser.com/ds/2/447/PYu-RC0402_51_RoHS_L_6_r-8721.pdf; ComponentLink1Description: Datasheet; Package: 0805
SA2 = Switch1_DTSM20-4.3: Switch open; Manufacturer: Diptronics; ManufacturerPartNumber: DTSM20-4.3; ComponentLink1Description: Datasheet; ComponentLink1URL: http://www.promelec.ru/catalog/407/1291/1323/1/70721/; ComponentLink2Description: Datasheet-local; ComponentLink2URL: *
SL9 = Touch_sensor: Bolt touch sensor
VT11-VT16 = 2N7002 n-MOSFET: 60V, 300mA N-channel Trench MOSFET; ManufacturerPartNumber: 2N7002
XS2 = Con6_M IDC-06M_SPI: SPI connector; ManufacturerPartNumber: IDC-06M; ComponentLink1Description: Datasheet; ComponentLink1URL: http://www.promelec.ru/catalog/406/1218/1223/1/156430/; ComponentLink2Description: Datasheet-local; ComponentLink2URL: *

## Sheet TransistorArray.SchDoc: Наименование
size 420 x 297 mm; ApprovedBy: Сидоров; CheckedBy: Петров; Author: Иванов; CompanyName: РГППУ; Title2str: Изделия; DecimalNumber: АБВГ.123456.001 33
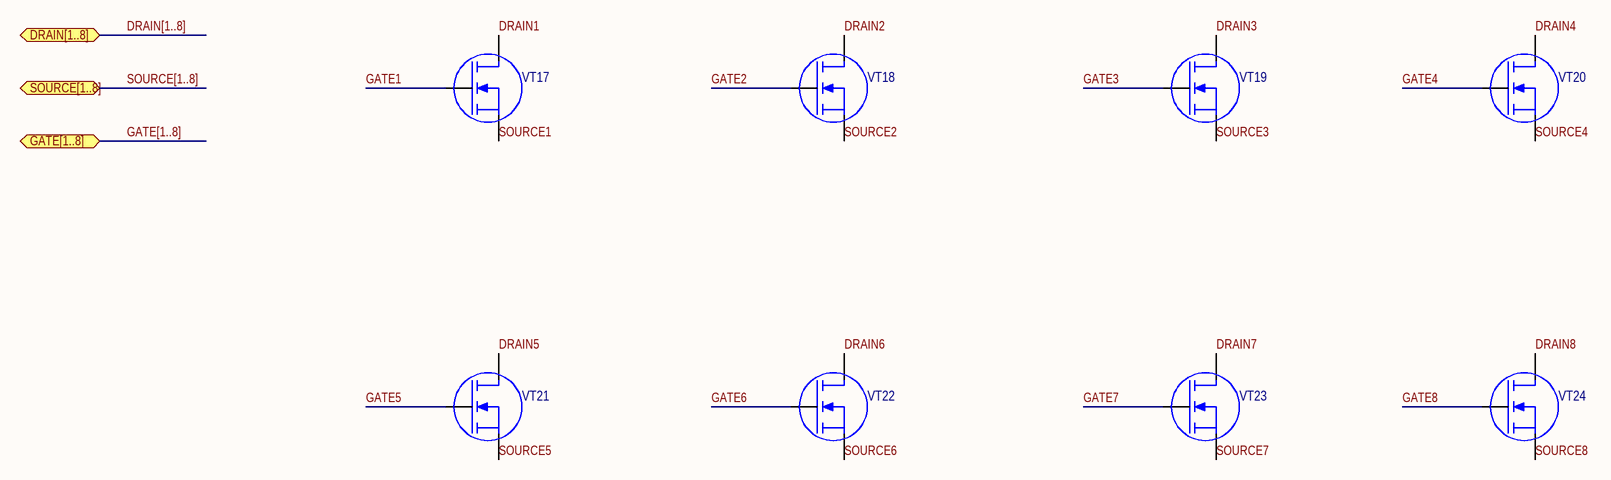
[diagram p4: TransistorArray.SchDoc]

### Parts
VT17  2N7002  [SOT23 (TO-236AB)]  (value not drawn)
VT18  2N7002  [SOT23 (TO-236AB)]  (value not drawn)
VT19  2N7002  [SOT23 (TO-236AB)]  (value not drawn)
VT20  2N7002  [SOT23 (TO-236AB)]  (value not drawn)
VT21  2N7002  [SOT23 (TO-236AB)]  (value not drawn)
VT22  2N7002  [SOT23 (TO-236AB)]  (value not drawn)
VT23  2N7002  [SOT23 (TO-236AB)]  (value not drawn)
VT24  2N7002  [SOT23 (TO-236AB)]  (value not drawn)

### Ports
DRAIN[1..8], GATE[1..8], SOURCE[1..8]

### Nets
DRAIN1: VT17.3(D)
DRAIN2: VT18.3(D)
DRAIN3: VT19.3(D)
DRAIN4: VT20.3(D)
DRAIN5: VT21.3(D)
DRAIN6: VT22.3(D)
DRAIN7: VT23.3(D)
DRAIN8: VT24.3(D)
GATE1: VT17.1(G)
GATE2: VT18.1(G)
GATE3: VT19.1(G)
GATE4: VT20.1(G)
GATE5: VT21.1(G)
GATE6: VT22.1(G)
GATE7: VT23.1(G)
GATE8: VT24.1(G)
SOURCE1: VT17.2(S)
SOURCE2: VT18.2(S)
SOURCE3: VT19.2(S)
SOURCE4: VT20.2(S)
SOURCE5: VT21.2(S)
SOURCE6: VT22.2(S)
SOURCE7: VT23.2(S)
SOURCE8: VT24.2(S)

### Buses and harness runs
bus DRAIN[1..8] = port DRAIN[1..8]
bus GATE[1..8] = port GATE[1..8]
bus SOURCE[1..8] = port SOURCE[1..8]

### Notes on the sheet
- Изм.
- Лист
- N*докум.
- Подп.
- Дата
- Лит.
- Масса
- Масштаб
- Разраб.
- Пров.
- Т.контр.
- Лиcт
- Лиcтов
- Н.контр.
- Утв.

### Library data of the parts
VT17-VT24 = 2N7002 n-MOSFET: 60V, 300mA N-channel Trench MOSFET; ManufacturerPartNumber: 2N7002

## Nets that join several sheets
+5V: TopShem (HL14.1 HL15.1), Control_Panel_Power (11 pins), Control_Panel (11 pins), Control_Panel_Part2 (HL11.1 HL12.1 L2.1)
GND: TopShem (VT25.2 VT26.2 XS3.8 XS6.2), Control_Panel_Power (29 pins), Control_Panel (13 pins), Control_Panel_Part2 (12 pins)
DRAIN1: Control_Panel_Part2 (R22.1), TransistorArray (VT17.3)
DRAIN2: Control_Panel_Part2 (R23.1), TransistorArray (VT18.3)
DRAIN3: Control_Panel_Part2 (R24.1), TransistorArray (VT19.3)
DRAIN4: Control_Panel_Part2 (R25.1), TransistorArray (VT20.3)
DRAIN5: Control_Panel_Part2 (R26.1), TransistorArray (VT21.3)
DRAIN6: Control_Panel_Part2 (R27.1), TransistorArray (VT22.3)
DRAIN7: Control_Panel_Part2 (R28.1), TransistorArray (VT23.3)
DRAIN8: Control_Panel_Part2 (R29.1), TransistorArray (VT24.3)
GATE1: Control_Panel_Part2 (R13.2), TransistorArray (VT17.1)
GATE2: Control_Panel_Part2 (R15.2), TransistorArray (VT18.1)
GATE3: Control_Panel_Part2 (R16.2), TransistorArray (VT19.1)
GATE4: Control_Panel_Part2 (R17.2), TransistorArray (VT20.1)
GATE5: Control_Panel_Part2 (R18.2), TransistorArray (VT21.1)
GATE6: Control_Panel_Part2 (R19.2), TransistorArray (VT22.1)
GATE7: Control_Panel_Part2 (R20.2), TransistorArray (VT23.1)
GATE8: Control_Panel_Part2 (R21.2), TransistorArray (VT24.1)
INT0: TopShem (XS3.3), Control_Panel (DD1.11), Control_Panel_Part2 (DD2.11)
INT1: TopShem (XS3.4), Control_Panel (DD1.12), Control_Panel_Part2 (DD2.12)
RX1: TopShem (XS4.1), Control_Panel (DD1.9)
RX2: TopShem (XS5.1), Control_Panel_Part2 (DD2.9)
SCL: TopShem (R34.2 XS3.5), Control_Panel (DD1.19), Control_Panel_Part2 (DD2.19)
SDA: TopShem (R35.2 XS3.6), Control_Panel (DD1.20), Control_Panel_Part2 (DD2.20)
SOURCE1: Control_Panel_Part2 (HG1.20 HG1.25 HG1.29 HG1.34), TransistorArray (VT17.2)
SOURCE2: Control_Panel_Part2 (HG1.19 HG1.24 HG1.28 HG1.33), TransistorArray (VT18.2)
SOURCE3: Control_Panel_Part2 (HG1.3 HG1.8 HG1.12 HG1.17), TransistorArray (VT19.2)
SOURCE4: Control_Panel_Part2 (HG1.2 HG1.6 HG1.11 HG1.15), TransistorArray (VT20.2)
SOURCE5: Control_Panel_Part2 (HG1.1 HG1.5 HG1.10 HG1.14), TransistorArray (VT21.2)
SOURCE6: Control_Panel_Part2 (HG1.21 HG1.27 HG1.30 HG1.36), TransistorArray (VT22.2)
SOURCE7: Control_Panel_Part2 (HG1.7 HG1.16 HG1.26 HG1.35), TransistorArray (VT23.2)
SOURCE8: Control_Panel_Part2 (HG1.4 HG1.9 HG1.13 HG1.18), TransistorArray (VT24.2)
TX1: TopShem (XS4.2), Control_Panel (DD1.10)
TX2: TopShem (XS5.2), Control_Panel_Part2 (DD2.10)
~15V_PHASE: TopShem (XS3.1), Control_Panel_Power (VD3.A VD5.K)
~15V_ZERO: TopShem (XS3.2), Control_Panel_Power (VD4.A VD6.K)